# EAGLE design -3V (EAGLE 6.6.0)
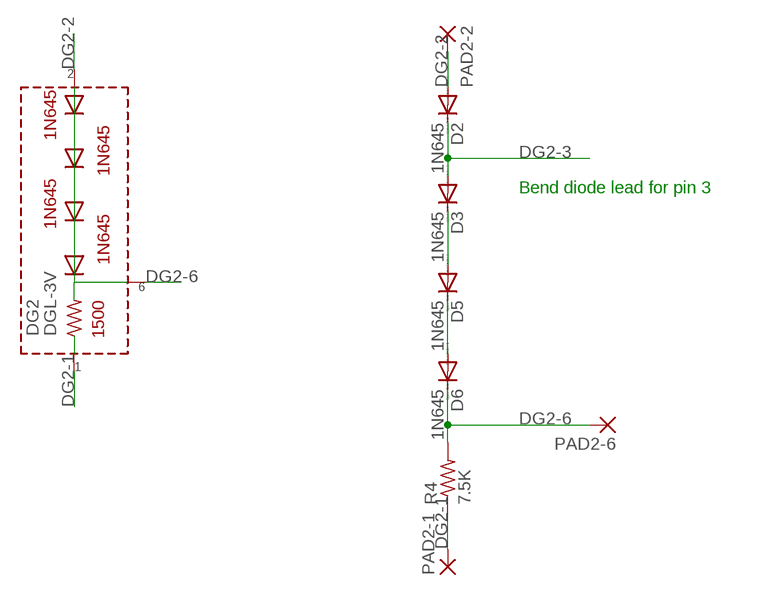
[diagram p0: schematic, sheet 1]

## Parts
D2  1N645  DIODE-DO34-7  [DO34-7]
D3  1N645  DIODE-DO34-7  [DO34-7]
D5  1N645  DIODE-DO34-7  [DO34-7]
D6  1N645  DIODE-DO34-7  [DO34-7]
DG2  DGL-3V  [DGL2]
PAD2-1  1,6/0,8  [1,6/0,8]
PAD2-2  1,6/0,8  [1,6/0,8]
PAD2-6  1,6/0,8  [1,6/0,8]
R4  7.5K  R-US_0207/7  [0207/7]

## Nets
DG2-1: DG2.P$1 PAD2-1.1(P) R4.1
DG2-2: D2.A DG2.P$2 PAD2-2.1(P)
DG2-3: D2.C D3.A
DG2-6: D6.C DG2.P$6 PAD2-6.1(P) R4.2
N$9: D5.C D6.A
N$12: D3.C D5.A

## Notes on the sheet
- Bend diode lead for pin 3

## Library data of the parts
D2 D3 D5 D6 = diode:DIODE-: DIODE
DG2 = dec-con:DGL-3V: -3V Clamp/Reference
PAD2-1 PAD2-2 PAD2-6 = wirepad:1,6/0,8: THROUGH-HOLE PAD
R4 = rcl:R-US_: RESISTOR, American symbol

## Net classes
0 default: width 0.406 mm

## Board
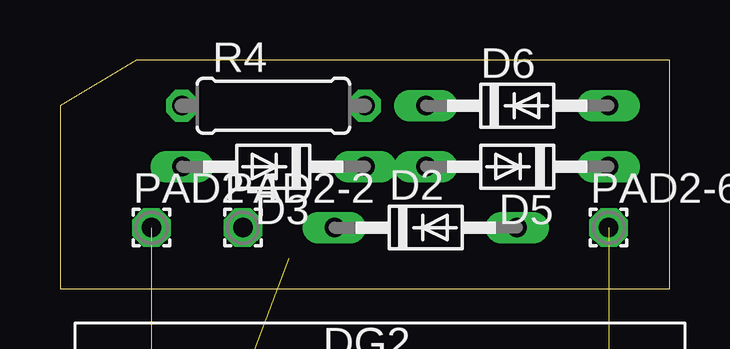
[diagram p1: board, top side]
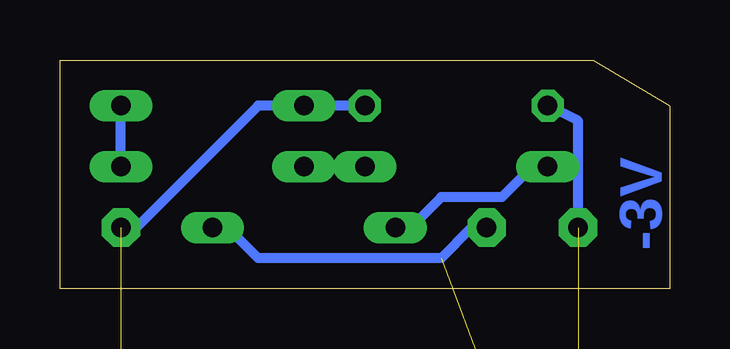
[diagram p2: board, bottom side, seen from below]

Size 25.4 x 9.53 mm. Coordinates in mm from the lower left corner, seen from the top.
Outline: 0,7.62 0,0 25.4,0 25.4,9.53 3.17,9.53 0,7.62
Copper layers (1*16): Top 0.035mm / dielectric 1.5mm / Bottom 0.035mm
Design rules "10mils": minimum track width 10mil, minimum drill 24mil, track to track 10mil, track to pad 10mil, pad to pad 10mil, via to via 10mil, smd to smd 10mil, copper to edge 25mil, drill to drill 10mil, minimum pad ring 10mil, minimum via ring 8mil, stop-mask expansion 0mil, vias tented up to drill 0mil, thermal gap 10mil

### Footprints (pad centres in the part's own frame; a part is rotated, then mirrored left to right if it is on the bottom)
DO34-7 = drill 0.813 long: A 3.81,0; C -3.81,0
DGL2 = drill 0.813: P$1 -9.525,0; P$2 -5.715,0; P$3 -1.905,0; P$4 1.905,0; P$5 5.715,0; P$6 9.525,0
1,6/0,8 = drill 0.813 pad 1.6 octagon: 1 0,0
0207/7 = drill 0.813 octagon: 1 -3.81,0; 2 3.81,0

### Placement (x,y rotation side)
D2  15.24,2.54 0 top
D3  8.89,5.08 180 top
D5  19.05,5.08 180 top
D6  19.05,7.62 0 top
DG2  13.34,-3.81 0 top  (outside the outline)
PAD2-1  3.81,2.54 0 top
PAD2-2  7.62,2.54 0 top
PAD2-6  22.86,2.54 0 top
R4  8.89,7.62 0 top

### Tracks (layer width: path | path; a pad name or v marks a point on that pad's centre or on a via)
DG2-1  (1 unrouted)
  Bottom 0.406: R4.1 3.81,6.99 PAD2-1.1
DG2-2  (1 unrouted)
  Bottom 0.406: D2.A 18.41,2.54 17.14,1.27 9.53,1.27 8.26,2.54 PAD2-2.1
DG2-3
  Bottom 0.406: D3.A 5.71,5.08 6.99,3.81 9.53,3.81 10.79,2.54 D2.C
DG2-6  (1 unrouted)
  Bottom 0.406: R4.2 D6.C 17.14,7.62 22.23,2.54 PAD2-6.1
N$9
  Bottom 0.406: D5.C D6.A
N$12
  Bottom 0.406: D3.C D5.A

### Text on the board
Bottom: -3V